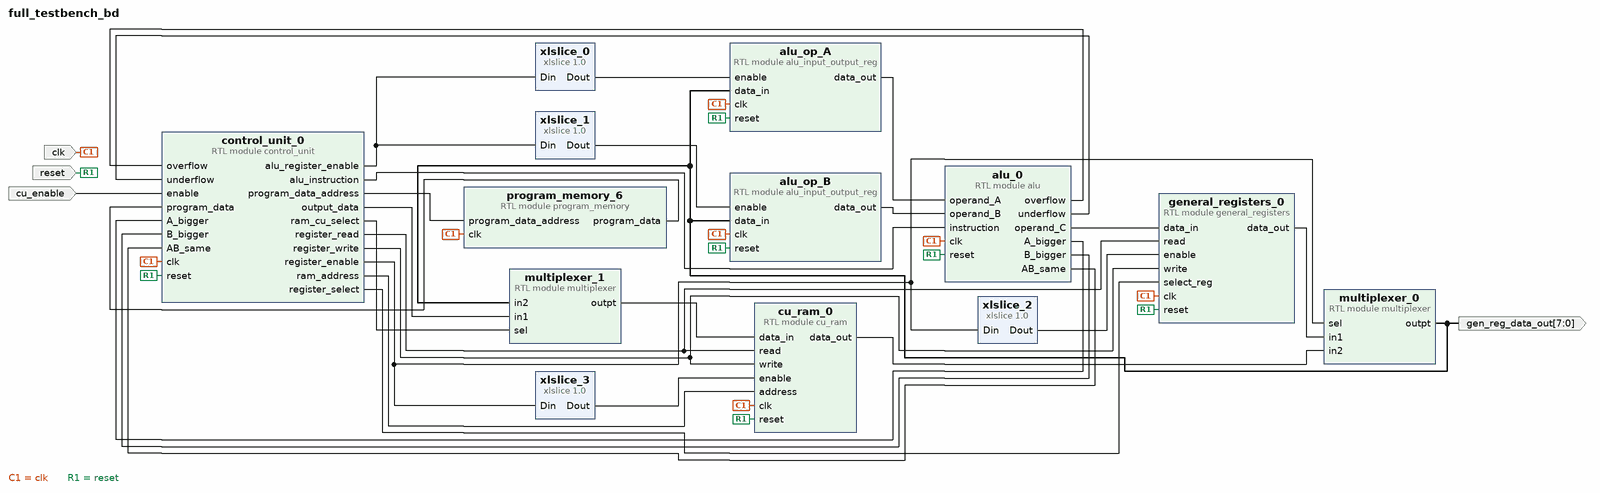
[diagram p0: block diagram of the top level]
# Vivado block design full_testbench_bd, xc7z007sclg225-1, Vivado 2020.2
create_bd_design full_testbench_bd

create_bd_port -dir I clk
create_bd_port -dir I cu_enable
create_bd_port -dir O -from 7 -to 0 -type data gen_reg_data_out
create_bd_port -dir I reset

create_bd_cell -type ip -vlnv xilinx.com:ip:xlslice:1.0 xlslice_0
set_property -dict {CONFIG.DIN_WIDTH 2} [get_bd_cells xlslice_0]
create_bd_cell -type ip -vlnv xilinx.com:ip:xlslice:1.0 xlslice_1
set_property -dict {CONFIG.DIN_FROM 1 CONFIG.DIN_TO 1 CONFIG.DIN_WIDTH 2 CONFIG.DOUT_WIDTH 1} [get_bd_cells xlslice_1]
create_bd_cell -type ip -vlnv xilinx.com:ip:xlslice:1.0 xlslice_2
set_property -dict {CONFIG.DIN_WIDTH 2} [get_bd_cells xlslice_2]
create_bd_cell -type ip -vlnv xilinx.com:ip:xlslice:1.0 xlslice_3
set_property -dict {CONFIG.DIN_FROM 1 CONFIG.DIN_TO 1 CONFIG.DIN_WIDTH 2 CONFIG.DOUT_WIDTH 1} [get_bd_cells xlslice_3]
create_bd_cell -type module -reference alu alu_0
create_bd_cell -type module -reference alu_input_output_reg alu_op_A
create_bd_cell -type module -reference alu_input_output_reg alu_op_B
create_bd_cell -type module -reference cu_ram cu_ram_0
create_bd_cell -type module -reference general_registers general_registers_0
create_bd_cell -type module -reference multiplexer multiplexer_0
create_bd_cell -type module -reference multiplexer multiplexer_1
create_bd_cell -type module -reference control_unit control_unit_0
create_bd_cell -type module -reference program_memory program_memory_6

# ---- connections ----

connect_bd_net [get_bd_pins alu_0/operand_C] [get_bd_pins general_registers_0/data_in]
connect_bd_net [get_bd_pins alu_0/overflow] [get_bd_pins control_unit_0/overflow]
connect_bd_net [get_bd_pins alu_0/underflow] [get_bd_pins control_unit_0/underflow]
connect_bd_net [get_bd_pins alu_op_A/data_out] [get_bd_pins alu_0/operand_A]
connect_bd_net [get_bd_pins alu_op_B/data_out] [get_bd_pins alu_0/operand_B]
connect_bd_net [get_bd_ports clk] \
  [get_bd_pins alu_0/clk] [get_bd_pins alu_op_A/clk] [get_bd_pins alu_op_B/clk] [get_bd_pins cu_ram_0/clk] \
  [get_bd_pins general_registers_0/clk] [get_bd_pins control_unit_0/clk] [get_bd_pins program_memory_6/clk]
connect_bd_net [get_bd_pins control_unit_0/alu_instruction] [get_bd_pins alu_0/instruction]
connect_bd_net [get_bd_pins control_unit_0/alu_register_enable] [get_bd_pins xlslice_1/Din] [get_bd_pins xlslice_0/Din]
connect_bd_net [get_bd_pins control_unit_0/register_read] [get_bd_pins cu_ram_0/read] [get_bd_pins general_registers_0/read]
connect_bd_net [get_bd_pins control_unit_0/register_select] [get_bd_pins general_registers_0/select_reg]
connect_bd_net [get_bd_pins control_unit_0/register_write] [get_bd_pins cu_ram_0/write] [get_bd_pins general_registers_0/write]
connect_bd_net [get_bd_ports cu_enable] [get_bd_pins control_unit_0/enable]
connect_bd_net [get_bd_ports reset] \
  [get_bd_pins alu_0/reset] [get_bd_pins alu_op_A/reset] [get_bd_pins alu_op_B/reset] [get_bd_pins cu_ram_0/reset] \
  [get_bd_pins general_registers_0/reset] [get_bd_pins control_unit_0/reset]
connect_bd_net [get_bd_pins xlslice_0/Dout] [get_bd_pins alu_op_A/enable]
connect_bd_net [get_bd_pins xlslice_1/Dout] [get_bd_pins alu_op_B/enable]
connect_bd_net [get_bd_pins control_unit_0/ram_address] [get_bd_pins cu_ram_0/address]
connect_bd_net [get_bd_pins xlslice_2/Dout] [get_bd_pins general_registers_0/enable]
connect_bd_net [get_bd_pins xlslice_3/Dout] [get_bd_pins cu_ram_0/enable]
connect_bd_net [get_bd_pins control_unit_0/register_enable] [get_bd_pins xlslice_2/Din] [get_bd_pins xlslice_3/Din] [get_bd_pins multiplexer_0/sel]
connect_bd_net -net multiplexer_0_out [get_bd_pins multiplexer_0/outpt] \
  [get_bd_ports gen_reg_data_out] [get_bd_pins alu_op_A/data_in] [get_bd_pins alu_op_B/data_in] \
  [get_bd_pins multiplexer_1/in2]
connect_bd_net [get_bd_pins general_registers_0/data_out] [get_bd_pins multiplexer_0/in1]
connect_bd_net [get_bd_pins cu_ram_0/data_out] [get_bd_pins multiplexer_0/in2]
connect_bd_net -net program_memory_0_program_data [get_bd_pins program_memory_6/program_data] [get_bd_pins control_unit_0/program_data]
connect_bd_net [get_bd_pins control_unit_0/program_data_address] [get_bd_pins program_memory_6/program_data_address]
connect_bd_net [get_bd_pins alu_0/A_bigger] [get_bd_pins control_unit_0/A_bigger]
connect_bd_net [get_bd_pins alu_0/B_bigger] [get_bd_pins control_unit_0/B_bigger]
connect_bd_net [get_bd_pins alu_0/AB_same] [get_bd_pins control_unit_0/AB_same]
connect_bd_net -net multiplexer_1_out [get_bd_pins multiplexer_1/outpt] [get_bd_pins cu_ram_0/data_in]
connect_bd_net [get_bd_pins control_unit_0/output_data] [get_bd_pins multiplexer_1/in1]
connect_bd_net [get_bd_pins control_unit_0/ram_cu_select] [get_bd_pins multiplexer_1/sel]

validate_bd_design
save_bd_design
